# EAGLE schematic Capacitor Thermal Gradient Test Board (EAGLE 6.3)
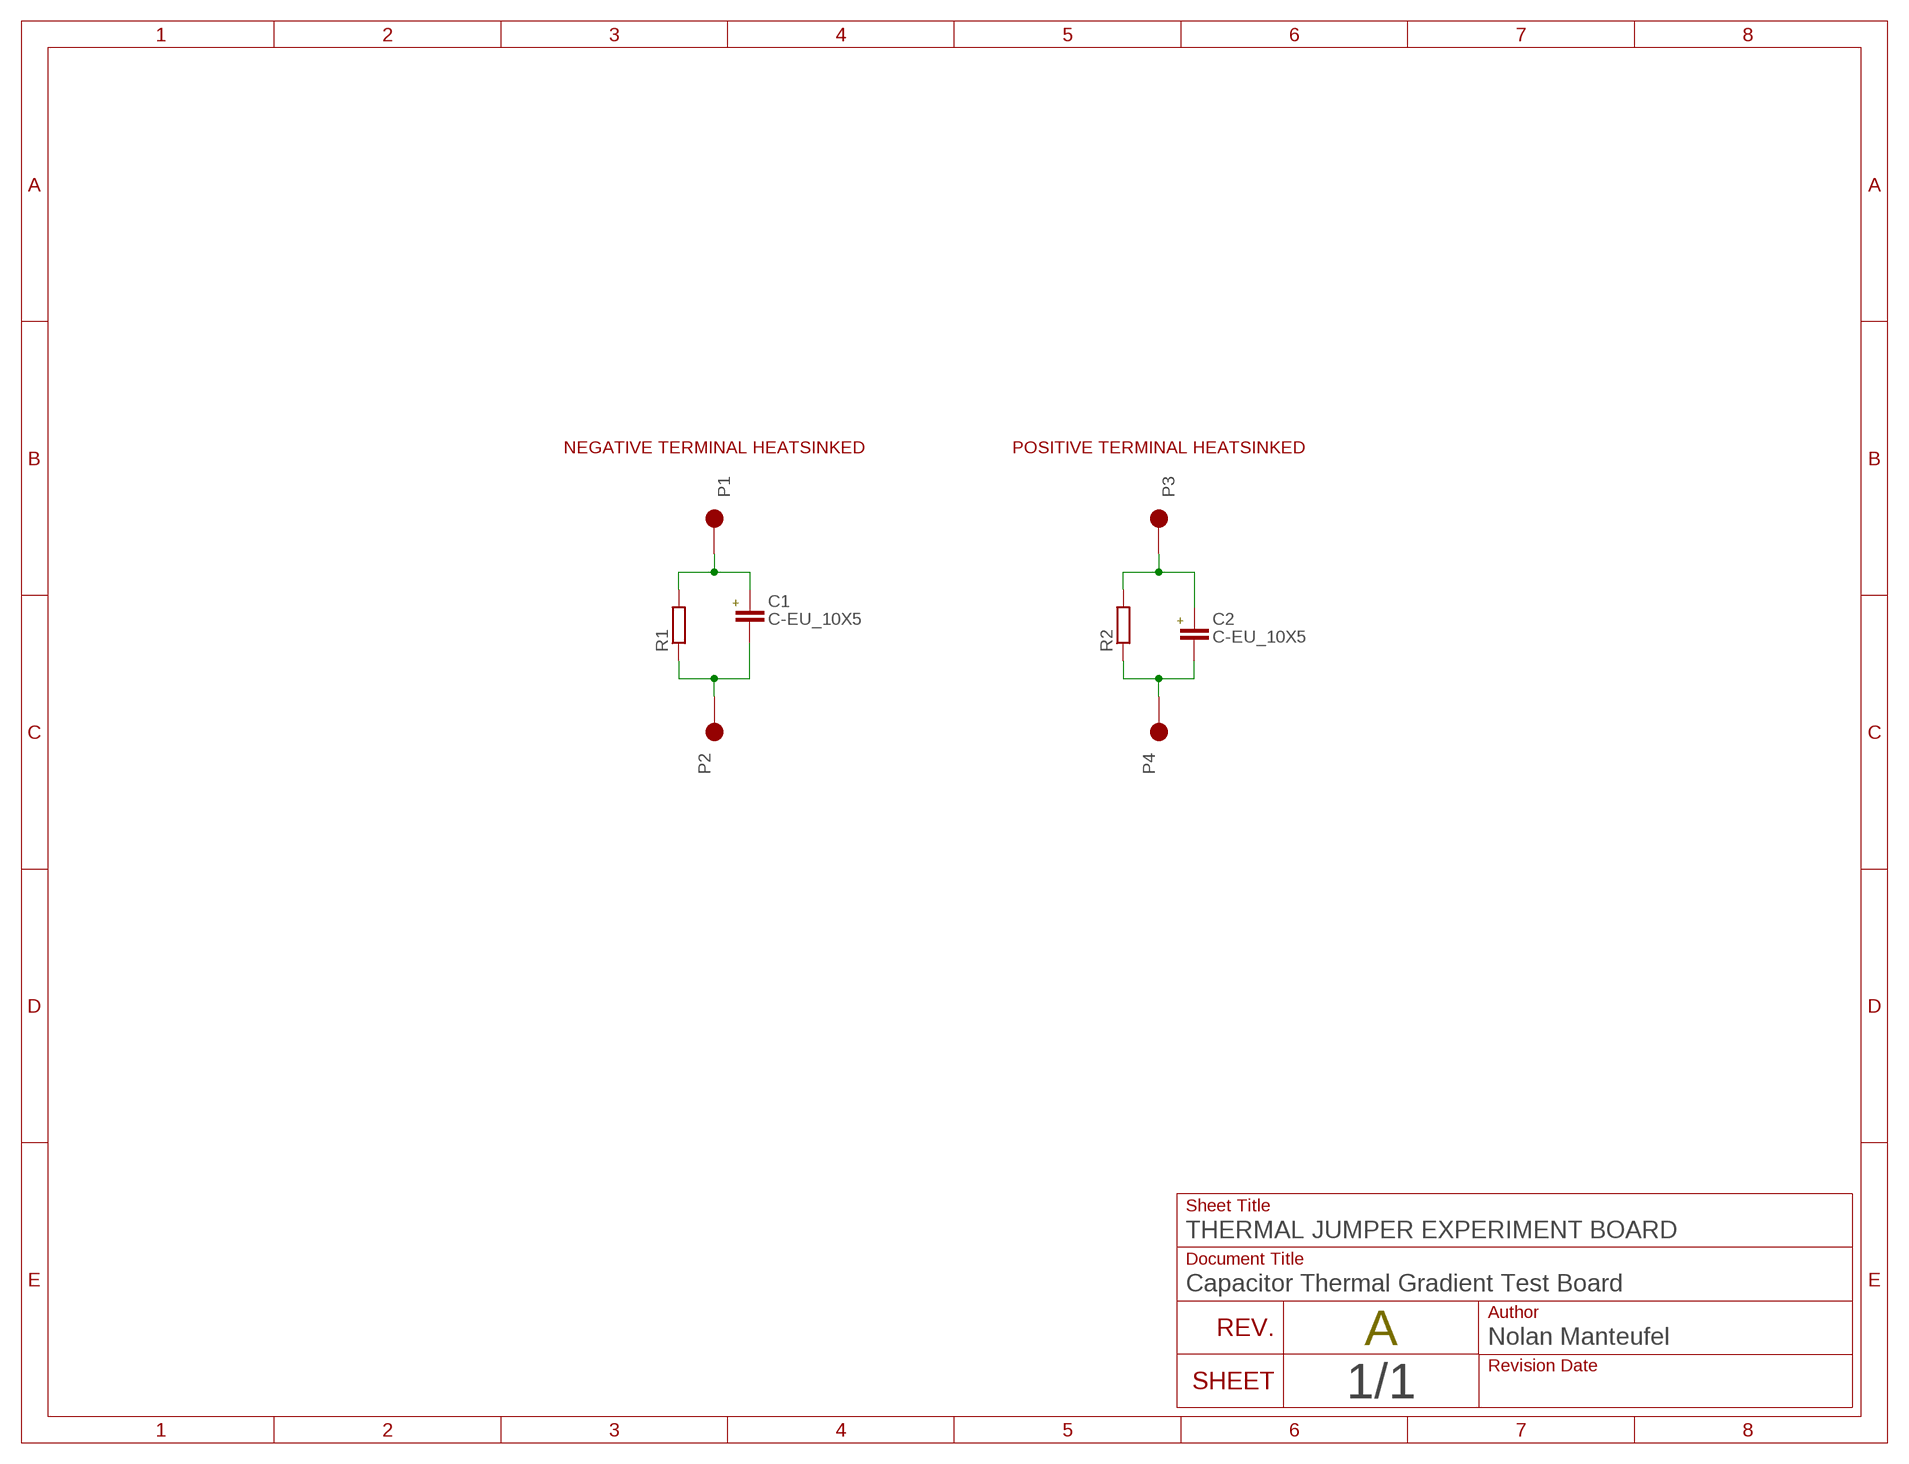
[diagram p0: schematic, sheet 1]

## Parts
C1  C-EU_10X5  [C_PZF_10]
C2  C-EU_10X5  [C_PZF_10]
P1  PINS_1_2MM2  [PINS_1_2MM2]
P2  PINS_1_2MM2  [PINS_1_2MM2]
P3  PINS_1_2MM2  [PINS_1_2MM2]
P4  PINS_1_2MM2  [PINS_1_2MM2]
R1  R-EU__VISHAY_THJP1225AST1  [R_THERMAL_1225]
R2  R-EU__VISHAY_THJP1225AST1  [R_THERMAL_1225]

## Nets
N$1: C1.1+ P1.1 R1.2
N$2: C1.2- P2.1 R1.1
N$3: C2.1+ P3.1 R2.2
N$4: C2.2- P4.1 R2.1

## Notes on the sheet
- NEGATIVE TERMINAL HEATSINKED | POSITIVE TERMINAL HEATSINKED

## Library data of the parts
C1 C2 = nolan:C-EU: CAPACITOR, European symbol
P1-P4 = nolan:PINS_1
R1 R2 = nolan:R-EU_: RESISTOR, European symbol